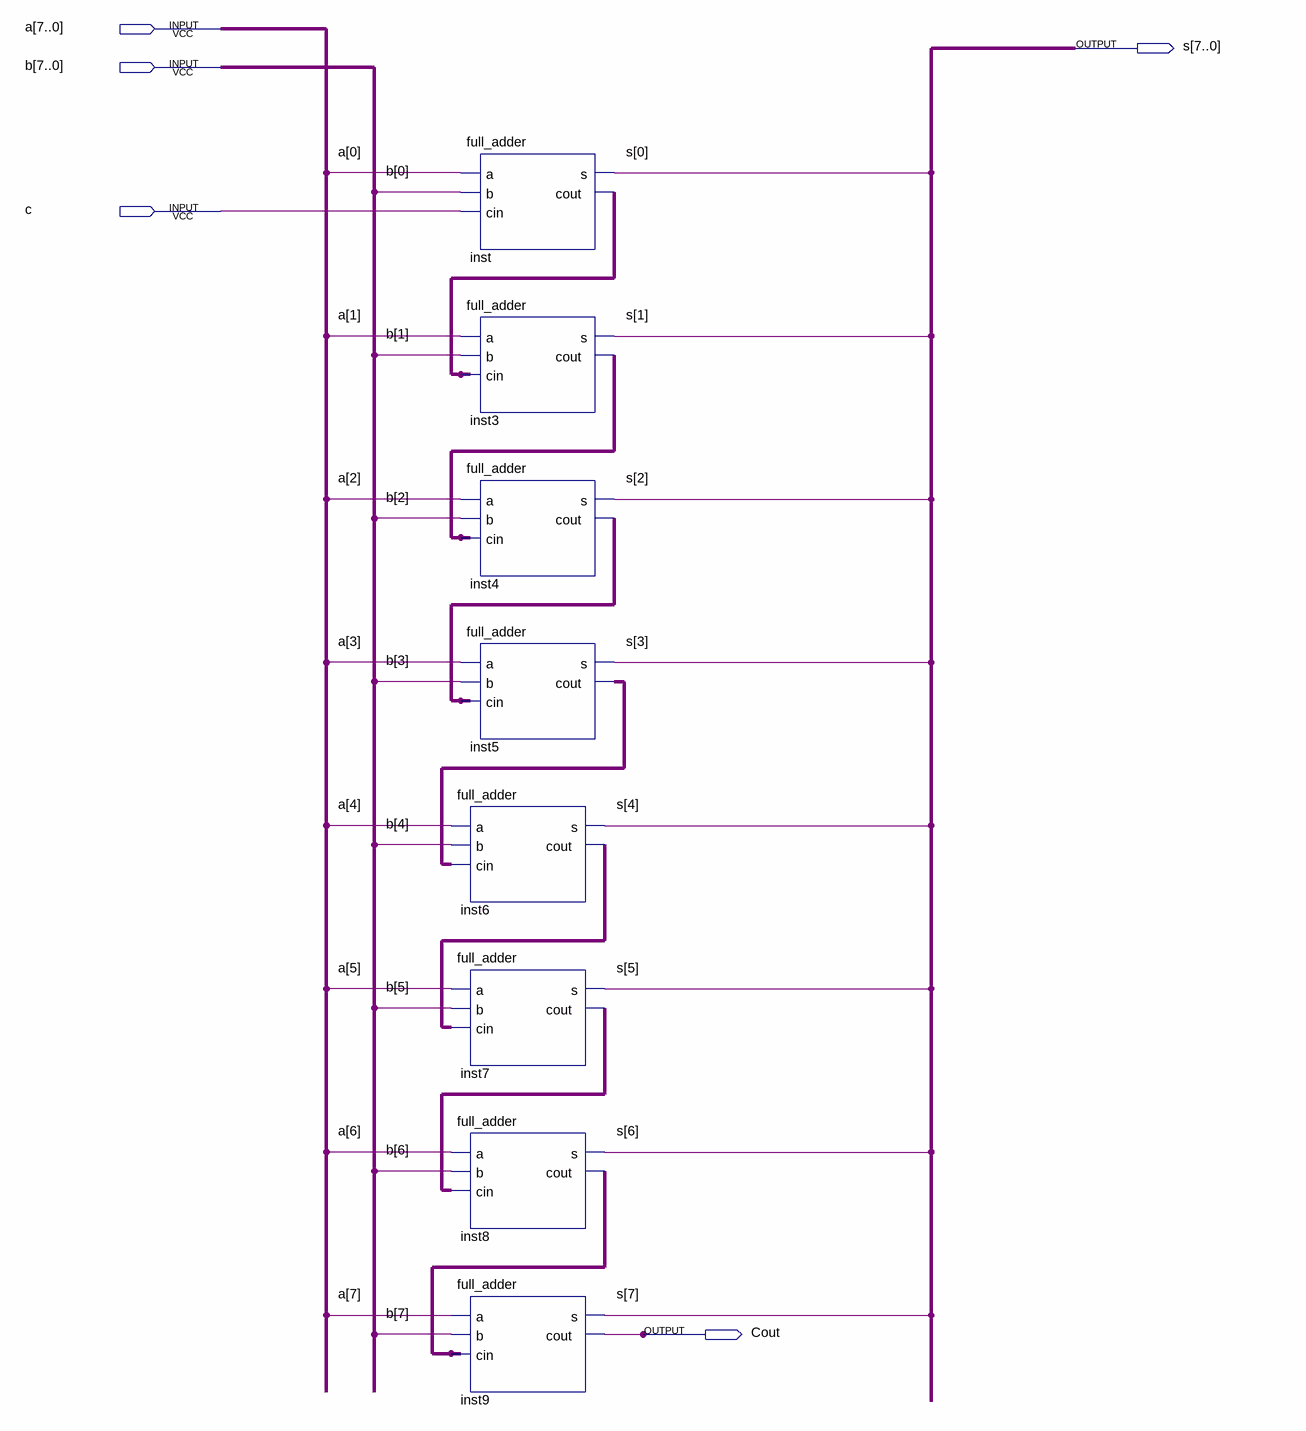
[diagram p0: schematic sheet]
// Quartus schematic full_adder_8b.bdf as structural Verilog: 8 symbols, 5 pins
module full_adder_8b (
  input  [7:0] a,
  input  [7:0] b,
  input  c,
  output [7:0] s,
  output Cout
);

  wire inst3_cout, inst4_cout, inst5_cout, inst6_cout, inst7_cout, inst8_cout, inst_cout;

  full_adder inst (.a(a[0]), .b(b[0]), .cin(c), .s(s[0]), .cout(inst_cout));
  full_adder inst3 (.a(a[1]), .b(b[1]), .cin(inst_cout), .s(s[1]), .cout(inst3_cout));
  full_adder inst4 (.a(a[2]), .b(b[2]), .cin(inst3_cout), .s(s[2]), .cout(inst4_cout));
  full_adder inst5 (.a(a[3]), .b(b[3]), .cin(inst4_cout), .s(s[3]), .cout(inst5_cout));
  full_adder inst6 (.a(a[4]), .b(b[4]), .cin(inst5_cout), .s(s[4]), .cout(inst6_cout));
  full_adder inst7 (.a(a[5]), .b(b[5]), .cin(inst6_cout), .s(s[5]), .cout(inst7_cout));
  full_adder inst8 (.a(a[6]), .b(b[6]), .cin(inst7_cout), .s(s[6]), .cout(inst8_cout));
  full_adder inst9 (.a(a[7]), .b(b[7]), .cin(inst8_cout), .s(s[7]), .cout(Cout));
endmodule
